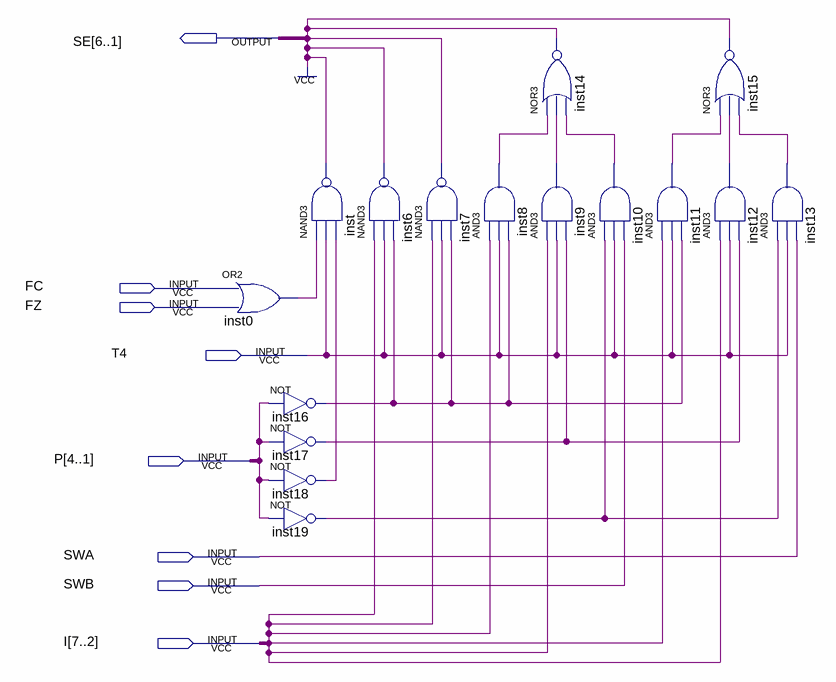
[diagram p0: schematic sheet]
// Quartus schematic ul_C.bdf as structural Verilog: 16 symbols, 8 pins
module ul_C (
  input  FC,
  input  FZ,
  input  T4,
  input  [4:1] P,
  input  SWA,
  input  SWB,
  input  [7:2] I,
  output [6:1] SE
);

  wire inst0_out, inst8_out, inst9_out, inst10_out, inst11_out, inst12_out, inst13_out, inst16_out,
       inst17_out, inst18_out, inst19_out, inst_out, undriven, undriven_2;

  or inst0 (inst0_out, FC, FZ);
  nand inst (inst_out, inst0_out, T4, inst18_out);
  not inst16 (inst16_out, undriven);
  not inst17 (inst17_out, undriven);
  not inst18 (inst18_out, undriven);
  not inst19 (inst19_out, undriven);
  nand inst6 (inst_out, undriven_2, T4, inst16_out);
  nand inst7 (inst_out, undriven_2, T4, inst16_out);
  and inst8 (inst8_out, undriven_2, T4, inst16_out);
  nor inst14 (inst_out, inst8_out, inst9_out, inst10_out);
  and inst9 (inst9_out, undriven_2, T4, inst17_out);
  and inst10 (inst10_out, inst19_out, T4, SWB);
  nor inst15 (inst_out, inst11_out, inst12_out, inst13_out);
  and inst11 (inst11_out, undriven_2, T4, inst16_out);
  and inst12 (inst12_out, undriven_2, T4, inst17_out);
  and inst13 (inst13_out, inst19_out, T4, SWA);
  // also tied to VCC on the sheet: inst_out
endmodule
